# EAGLE schematic placa1 (EAGLE 7.7.0)
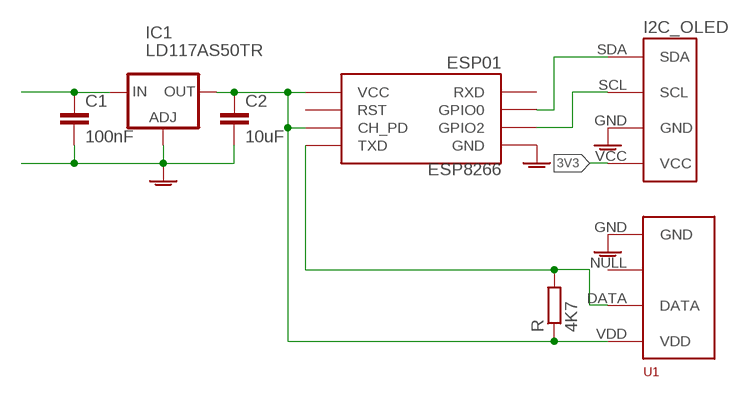
[diagram p0: schematic, sheet 1]

## Parts
C1  100nF  C-EUC1206K  [C1206K]
C2  10uF  C-EUC1206K  [C1206K]
ESP8266  ESP01  [ESP01]
IC1  LD117AS50TR  [SOT223]
OLED  I2C_OLED  [I2C_OLED_PACKAGE]
R  4K7  R-EU_R1206  [R1206]
U1  RHT03_DHT-22_AM2302RA  [RHT03_DHT-22/RA]

## Nets
3V3: C2.1 ESP8266.CH_PD ESP8266.VCC IC1.2(OUT) OLED.VCC R.1 U1.VDD
5V: C1.1 IC1.3(IN)
DATA: ESP8266.TX(TXD) R.2 U1.DATA
GND: C1.2 C2.2 ESP8266.GND IC1.1(ADJ) OLED.GND U1.GND ; supply symbol labelled GNDA
SCL: ESP8266.GPIO2 OLED.SCL
SDA: ESP8266.GPIO0 OLED.SDA
Unconnected: ESP8266.RST ESP8266.RX(RXD) U1.NULL

## Library data of the parts
C1 C2 = rcl:C-EU: CAPACITOR, European symbol
ESP8266 = esp8266modules:ESP01: ESP8266 Wifi module 01
IC1 = v-reg:LD117A?*: Low drop fixed and adjustable positive voltage regulators 1 A Source: http://www.st.com/stonline/products/literature/ds/7194/ld1117axx.pdf
OLED = DIYMall_OLED:I2C_OLED
R = rcl:R-EU_: RESISTOR, European symbol
U1 = RHT03_DHT-22_AM2302:RHT03_DHT-22_AM2302: RHT03 / DHT-22 / AM2302 Packages and symbol for the RHT03 / DHT-22 relative humidity and temperature sensor. Note: The AM2302 is a wired version of the DHT-22 which typically requires less clearance and is thus provided as a separate package.; PROD_ID: SEN-10167